# EAGLE schematic Cansat2019_1516_Payload_SectionA_v01 (EAGLE 7.3.0)
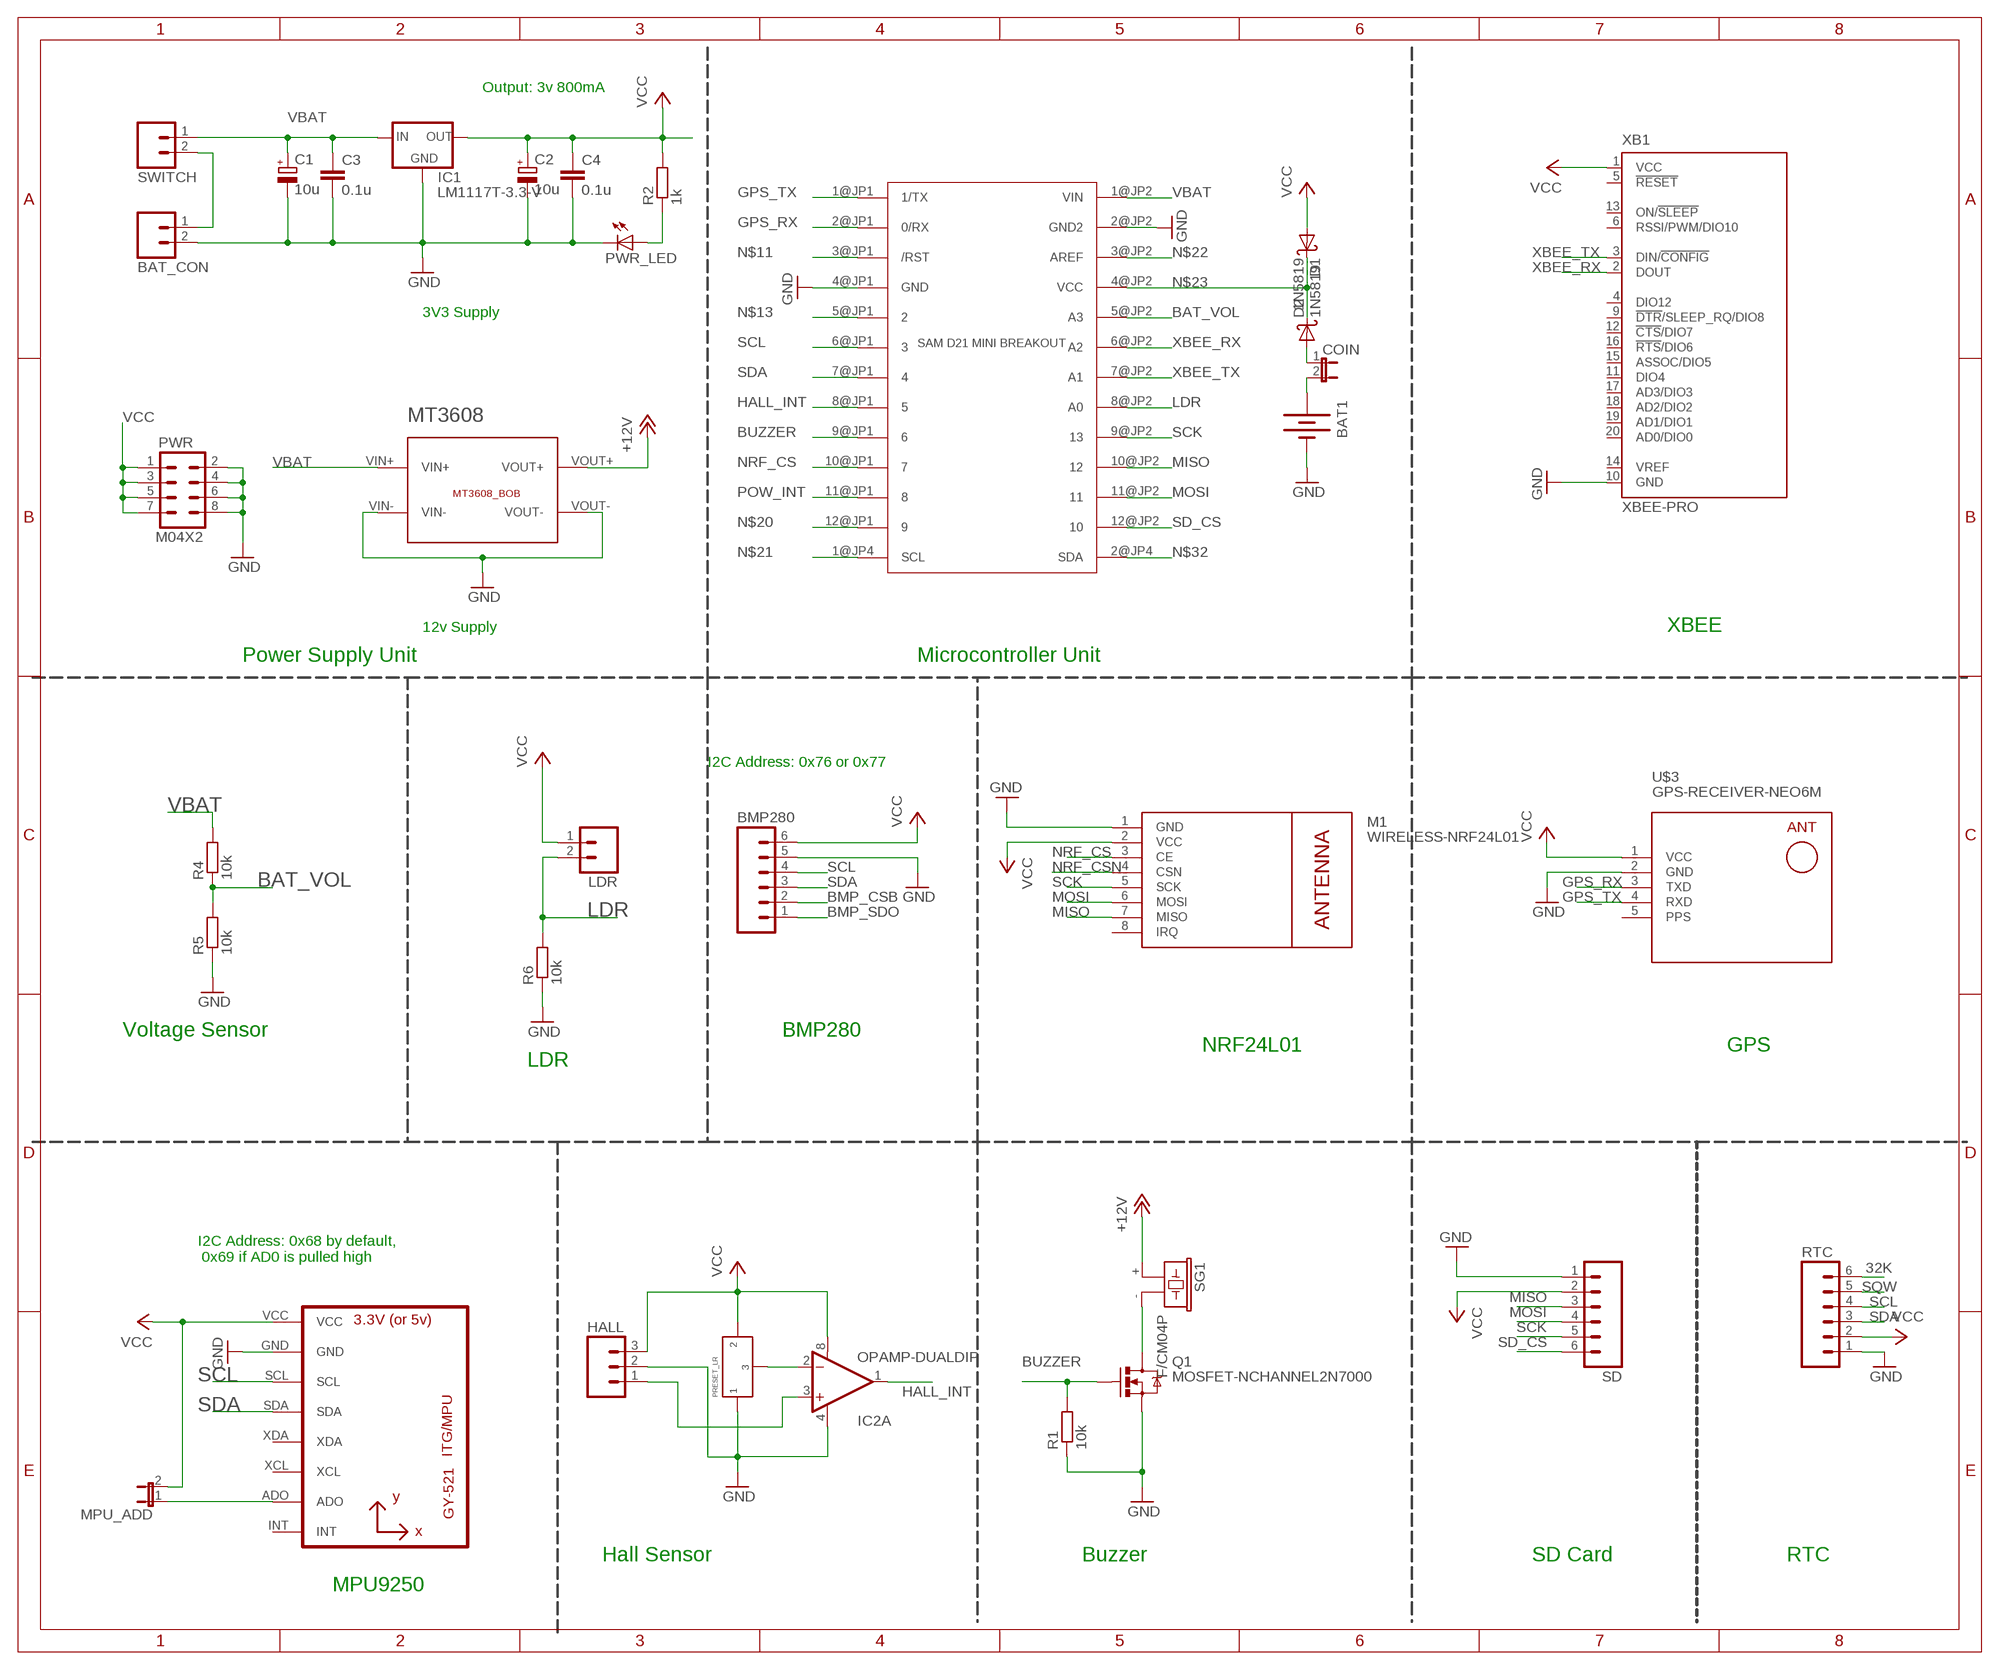
[diagram p0: schematic, sheet 1]

## Parts
BAT1  BATTERY20PTH  [BATTCOM_20MM_PTH]
BAT_CON  M02  [02P]
BMP280  M06  [06P]
C1  10u  CPOL-EUE2.5-6  [E2,5-6]
C2  10u  CPOL-EUE2.5-6  [E2,5-6]
C3  0.1u  C-EU025-025X050  [C025-025X050]
C4  0.1u  C-EU025-025X050  [C025-025X050]
COIN  JUMPER-2PTH  [1X02]
D1  1N5819  [DO41-10]
D2  1N5819  [DO41-10]
HALL  M03  [03P]
IC1  LM1117T-3.3-V  [TO220V]
IC2  OPAMP-DUALDIP  [DIP08]
LDR  M02  [02P]
M1  WIRELESS-NRF24L01  [WIRELESS-NRF24L01]
MPU_ADD  JUMPER-2PTH  [1X02]
MT3608  MT3608_BOB  [MT3608_BOB]
PWR  M04X2  [2X4]
PWR_LED  LED3MM  [LED3MM]
Q1  MOSFET-NCHANNEL2N7000  [TO-92]
R1  10k  R-EU_0204/7  [0204/7]
R2  1k  R-EU_0204/7  [0204/7]
R4  10k  R-EU_0204/7  [0204/7]
R5  10k  R-EU_0204/7  [0204/7]
R6  10k  R-EU_0204/7  [0204/7]
RTC  M06  [06P]
SD  M06  [06P]
SG1  F/CM04P  [F/CM04P]
SWITCH  M02  [02P]
U1  GY-521MPU6050  [GY-521]
U$1  SAM_D21_MINI_BREAKOUT  [JP1_SPARKFUN-SAMD21-MINI-BREAKOUT-V10]
U$2  PRESET_LR  [PRESET_LR]
U$3  GPS-RECEIVER-NEO6M  [GPS-RECEIVER-NEO6M]
XB1  XBEE-PRO  [XBEE-PRO]

## Nets
32K: RTC.6
+12V [power]: MT3608.VOUT+ SG1.+
BAT_VOL: R4.1 R5.2 U$1.5@JP2(A3)
BMP_CSB: BMP280.2
BMP_SDO: BMP280.1
BUZZER: Q1.2(G) R1.2 U$1.9@JP1
GND [power]: BAT1.2(-) BAT_CON.2 BMP280.5 C1.- C2.- C3.2 C4.2 HALL.2 IC1.1(GND) IC2.4(A:V-) M1.1(GND) MT3608.VIN- MT3608.VOUT- PWR.2 PWR.4 PWR.6 PWR.8 PWR_LED.K(C) Q1.1(S) R1.1 R5.1 R6.1 RTC.1 SD.1 U1.GND U$1.2@JP2(GND2) U$1.4@JP1(GND) U$2.P$1 U$3.2(GND) XB1.10(GND)
GPS_RX: U$1.2@JP1(0/RX) U$3.3(TXD)
GPS_TX: U$1.1@JP1(1/TX) U$3.4(RXD)
HALL_INT: IC2.1(A:OUT) U$1.8@JP1
LDR: LDR.2 R6.2 U$1.8@JP2(A0)
MISO: M1.7(MISO) SD.3 U$1.10@JP2
MOSI: M1.6(MOSI) SD.4 U$1.11@JP2
N$1: Q1.3(D) SG1.-
N$2: COIN.1 D2.A
N$3: PWR_LED.A R2.1
N$5: BAT1.1(+) COIN.2
N$6 [power]: BAT_CON.1 SWITCH.2
N$7: HALL.1 IC2.3(A:+IN)
N$9: MPU_ADD.1 U1.ADO
N$11: U$1.3@JP1(/RST)
N$12: IC2.2(A:-IN) U$2.P$3
N$13: U$1.5@JP1
N$20: U$1.12@JP1
N$21: U$1.1@JP4(SCL)
N$22: U$1.3@JP2(AREF)
N$23: D1.C D2.C U$1.4@JP2(VCC)
N$32: U$1.2@JP4(SDA)
NRF_CS: M1.3(CE) U$1.10@JP1
NRF_CSN: M1.4(CSN)
POW_INT: U$1.11@JP1
SCK: M1.5(SCK) SD.5 U$1.9@JP2
SCL: BMP280.4 RTC.4 U1.SCL U$1.6@JP1
SD_CS: SD.6 U$1.12@JP2
SDA: BMP280.3 RTC.3 U1.SDA U$1.7@JP1
SQW: RTC.5
VBAT [power]: C1.+ C3.1 IC1.3(IN) MT3608.VIN+ R4.2 SWITCH.1 U$1.1@JP2(VIN)
VCC [power]: BMP280.6 C2.+ C4.1 D1.A HALL.3 IC1.2(OUT) IC2.8(A:V+) LDR.1 M1.2(VCC) MPU_ADD.2 PWR.1 PWR.3 PWR.5 PWR.7 R2.2 RTC.2 SD.2 U1.VCC U$2.P$2 U$3.1(VCC) XB1.1(VCC)
XBEE_RX: U$1.6@JP2(A2) XB1.2(DOUT)
XBEE_TX: U$1.7@JP2(A1) XB1.3(DIN/!CONFIG)
Unconnected: IC2.5(B:+IN) IC2.6(B:-IN) IC2.7(B:OUT) M1.8(IRQ) U1.INT U1.XCL U1.XDA XB1.4(DIO12) XB1.5(!RESET) XB1.6(RSSI/PWM/DIO10) XB1.9(!DTR!/SLEEP_RQ/DIO8) XB1.11(DIO4) XB1.12(!CTS!/DIO7) XB1.13(ON/!SLEEP) XB1.14(VREF) XB1.15(ASSOC/DIO5) XB1.16(!RTS!/DIO6) XB1.17(AD3/DIO3) XB1.18(AD2/DIO2) XB1.19(AD1/DIO1) XB1.20(AD0/DIO0)

## Notes on the sheet
- Output: 3v 800mA
- 3V3 Supply
- 12v Supply | XBEE
- Power Supply Unit | Microcontroller Unit
- I2C Address: 0x76 or 0x77
- Voltage Sensor | BMP280
- NRF24L01 | GPS
- LDR
- I2C Address: 0x68 by default,
   0x69 if AD0 is pulled high
- Hall Sensor | Buzzer | SD Card | RTC
- MPU9250

## Power pins joined to a net without a drawn wire
PPS: U$3.5(PPS)

## Library data of the parts
BAT1 = MSP-MB_V12:BATTERY: Battery Holders Various common sizes : AA, AAA, 18650 (PRT-12895), 20mm coin cell and 12mm coin cell. 20MM_4LEGS, BATT-10373
BAT_CON LDR SWITCH = CEDT_JANUARY_2015_v5:M02: AMP QUICK CONNECTOR
BMP280 RTC SD = con-amp-quick:M06: AMP QUICK CONNECTOR; OC_FARNELL: unknown; OC_NEWARK: unknown
C1 C2 = rcl:CPOL-EU: POLARIZED CAPACITOR, European symbol
C3 C4 = rcl:C-EU: CAPACITOR, European symbol
COIN MPU_ADD = SparkFun-Retired:JUMPER-2: Jumper Basic 0.1" spaced jumper. Use with breakaway headers.
D1 D2 = CEDT_JANUARY_2015_v6 (2):1N5819: DIODE general purpose rectifier, 1 A
HALL = msp framework:M03: AMP QUICK CONNECTOR
IC1 = lm1117:LM1117T-*
IC2 = SparkFun-AnalogIC:OPAMP-DUAL: Generic op-amp footprint
M1 = diy-modules:WIRELESS-NRF24L01: 2.4 GHz Wireless Module based on NRF24L01 chip More details available here: http://www.electrodragon.com/w/NRF24L01 Click here to find device on ebay.com <http://www.ebay.com/sch/nrf24l01+arduino>
MT3608 = Breakouts:MT3608_BOB
PWR = SparkFun-Connectors:M04X2: .1" header, two rows of four.
PWR_LED = 01_adafruit:LED: LED OSRAM: - CHIPLED LG R971, LG N971, LY N971, LG Q971, LY Q971, LO R971, LY R971 LH N974, LH R974 LS Q976, LO Q976, LY Q976 LO Q996 - Hyper CHIPLED LW Q18S LB Q993, LB Q99A, LB R99A - SideLED LS A670, LO A670, LY A670, LG A670, LP A670 LB A673, LV A673, LT A673, LW A673 LH A674 LY A675 LS A676, LA A676, LO A676, LY A676, LW A676 LS A679, LY A679, LG A679 - Hyper Micro SIDELED® LS Y876, LA Y876, LO Y876, LY Y876 LT Y87S - SmartLED LW L88C, LW L88S LB L89C, LB L89S, LG L890 LS L89K, LO L89K, LY L89K LS L896, LA L896, LO L896, LY L896 - TOPLED LS T670, LO T670, LY T670, LG T670, LP T670 LSG T670, LSP T670, LSY T670, LOP T670, LYG T670 LG T671, LOG T671, LSG T671 LB T673, LV T673, LT T673, LW T673 LH T674 LS T676, LA T676, LO T676, LY T676, LB T676, LH T676, LSB T676, LW T676 LB T67C, LV T67C, LT T67C, LS T67K, LO T67K, LY T67K, LW E67C LS E67B, LA E67B, LO E67B, LY E67B, LB E67C, LV E67C, LT E67C LW T67C LS T679, LY T679, LG T679 LS T770, LO T770, LY T770, LG T770, LP T770 LB T773, LV T773, LT T773, LW T773 LH T774 LS E675, LA E675, LY E675, LS T675 LS T776, LA T776, LO T776, LY T776, LB T776 LHGB T686 LT T68C, LB T68C - Hyper Mini TOPLED® LB M676 - Mini TOPLED Santana® LG M470 LS M47K, LO M47K, LY M47K Source: http://www.osram.convergy.de/
Q1 = SparkFun-DiscreteSemi:MOSFET-NCHANNEL: Common NMOSFET Parts MFG P/N Store ID Prod ID FDD8780 TRANS-09984 SI7820DN TRANS-11055 FDS6630A IC-08089 2N7002PW TRANS-11151 FQP30N06L COM-10213 TRANS-10060 BSS123LT1G TRANS-08345 BSS138 TRANS-00830 BS170 2N7000
R1 R2 R4-R6 = rcl:R-EU_: RESISTOR, European symbol
SG1 = buzzer:F/CM04P: BUZZER Source: Buerklin; OC_FARNELL: unknown; OC_NEWARK: unknown
U1 = gy-521:GY-521
U$1 = SparkFun-SAMD21-Mini-Breakout:SAM_D21_MINI_BREAKOUT: SPARKFUN-SAMD21-MINI-BREAKOUT
U$2 = CEDT_JANUARY_2015_v6 (2):PRESET_LR
U$3 = diy-modules:GPS-RECEIVER-NEO6M: GPS Receiver Module based on NEO-6 device Short tutorial how to use NEO-6 module with Arduino: http://www.xarg.org/2016/06/neo6mv2-gps-module-with-arduino/ NEO-6 datasheet is available here: https://www.u-blox.com/sites/default/files/products/documents/NEO-6_DataSheet_%28GPS.G6-HW-09005%29.pdf Click here to find device on ebay.com <http://www.ebay.com/sch/gyneo6mv2>
XB1 = xbee:XBEE: XBee (TM) /XBee-PRO(TM) OEM RF Modules Source: MaxStream, Inc. xbee_productmanual.pdf; MPN: XBP24-AWI-001; OC_FARNELL: 1337916; OC_NEWARK: 42M2667

## Net classes
1 power: width 0.61 mm, clearance 0.305 mm
2 burner: width 0.813 mm, clearance 0.305 mm